# Altium schematic sheet JBC_PD_Front_End.SchDoc
size A4
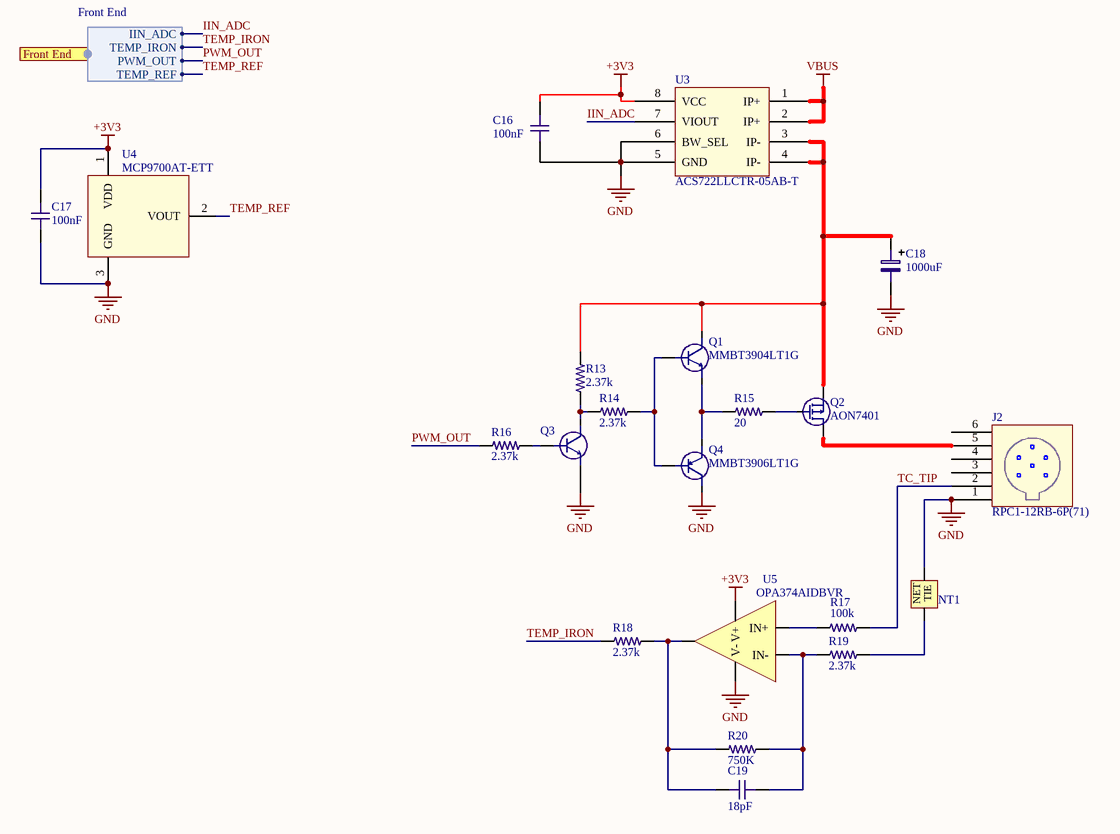
[diagram p0: JBC_PD_Front_End.SchDoc]

## Parts
C16  value 100nF  [C0603-IPC]  (hidden comment: C0603 100nF 25V X7R)
C17  value 100nF  [C0603-IPC]  (hidden comment: C0603 100nF 25V X7R)
C18  value 1000uF  [C-POLARIZED-5-12.5 Horizontal]  (hidden comment: 35ZLH1000MEFC12.5X20)
C19  value 18pF  [C0402-IPC]  (hidden comment: C0402 18pF 50V C0G_1)
J2  RPC1-12RB-6P(71)  [HIROSE RPC 1 SMD (WIRE)]
NT1  Net Tie  [NET_TIE]  (value not drawn)  (net tie, no BOM)
Q1  MMBT3904LT1G  [SOT23-MMBT3904]
Q2  AON7401  [DFN3x3A_8L_EP1_P]
Q3  MMBT3904LT1G  [SOT23-MMBT3904]  (value not drawn)
Q4  MMBT3906LT1G  [SOT23-Generic]
R13  value 2.37k  [R0603-IPC]  (hidden comment: R0603 2.37K 1%)
R14  value 2.37k  [R0603-IPC]  (hidden comment: R0603 2.37K 1%)
R15  value 20  [R1206-IPC]  (hidden comment: R1206 20 1%)
R16  value 2.37k  [R0603-IPC]  (hidden comment: R0603 2.37K 1%)
R17  value 100k  [R0603-IPC]  (hidden comment: R0603 100K 1%)
R18  value 2.37k  [R0603-IPC]  (hidden comment: R0603 2.37K 1%)
R19  value 2.37k  [R0603-IPC]  (hidden comment: R0603 2.37K 1%)
R20  value 750K  [R0603-IPC]  (hidden comment: RC0603FR-07750KL)
U3  ACS722LLCTR-05AB-T  [SOIC127P600X175-8N]
U4  MCP9700AT-ETT  [SOT23]
U5  OPA374AIDBVR  [DBV0005A]

## Ports
Front End (harness Front End)

## Harnesses
Front End: IIN_ADC, TEMP_IRON, PWM_OUT, TEMP_REF

## Nets
+3V3: C16.2 C17.2 U3.8(VCC) U4.1(VDD) U5.5(V+)
GND: C16.1 C17.1 C18.2 J2.1 NT1.2 Q3.2(E) Q4.3(C) U3.5(GND) U3.6(BW_SEL) U4.3(GND) U5.2(V-)
VBUS: U3.1(IP+) U3.2(IP+)
IIN_ADC: U3.7(VIOUT) ; port Front End.IIN_ADC
PWM_OUT: R16.1 ; port Front End.PWM_OUT
TC_TIP: J2.2 R17.1
TEMP_IRON: R18.1 ; port Front End.TEMP_IRON
TEMP_REF: U4.2(VOUT) ; port Front End.TEMP_REF
NetC18_1: C18.1 Q1.3(C) Q2.S R13.2 U3.3(IP-) U3.4(IP-)
NetC19_1: C19.1 R18.2 R20.1 U5.1(VOUT)
NetC19_2: C19.2 R19.1 R20.2 U5.4(IN-)
NetJ2_5: J2.5 Q2.D
NetNT1_1: NT1.1 R19.2
NetQ1_1: Q1.1(B) Q4.1(B) R14.2
NetQ1_2: Q1.2(E) Q4.2(E) R15.1
NetQ2_G: Q2.G R15.2
NetQ3_1: Q3.1(B) R16.2
NetQ3_3: Q3.3(C) R13.1 R14.1
NetR17_2: R17.2 U5.3(IN+)

Not connected (* = marked no-connect by the designer): J2 3 4 6

## Notes on the sheet
- (in symbol Net Tie) TIE; NET

## Library data of the parts
C16 C17 = C0603 100nF 25V X7R: Chip Capacitor, 0603, 100nF, 25V, X7R; EIA Code: X7R; Max. Voltage: 25V; Supplier 1: Digi-Key; Supplier Part Number 1: 490-1524-1-ND
C18 = C-THT 1000uF 35V Electrolytic: 1000uF ±20% 35V 12.5x20 10000Hrs @ 105℃ Radial,12.5x20mm Aluminum Electrolytic Capacitors - Leaded RoHS; Supplier 1: Digi-Key; Supplier 2: Mouser; Supplier 3: LCSC; Supplier Part Number 1: 1189-1888-ND; Supplier Part Number 2: 232-LH1000MEFC125X20; Supplier Part Number 3: C338194
C19 = C0402 18pF 50V C0G_1: Chip Capacitor, 0402, 18pF, 25V, C0G; Max. Voltage: 25V; Supplier 1: Digi-Key; Supplier Part Number 1: 399-14427-1-ND; EIA Code: C0G
J2 = Hirose RPC1: 6 Position Circular Connector Receptacle, Male Pins Solder Cup (JBC Iron Conn); Supplier 1: Digi-Key; Supplier 2: Mouser; Supplier Part Number 1: HR1817-ND; Supplier Part Number 2: 798-RPC112RB6P71
Q1 Q3 = MMBT3904LT1G: Bipolar (BJT) Transistor NPN 40V 200mA 300MHz 300mW Surface Mount SOT-23-3 (TO-236); I_max: 200mA; V_brkdown: 40V; Supplier 1: Digi-Key; Supplier 2: Mouser; Supplier 3: LCSC; Supplier Part Number 1: MMBT3904LT1GOSDKR-ND; Supplier Part Number 2: 863-MMBT3904LT1G; Supplier Part Number 3: C81464
Q2 = AON7401: P-Channel 30V 12A (Ta), 35A (Tc) 3.1W (Ta), 29W (Tc) Surface Mount 8-DFN (3x3); Supplier 1: Digi-Key; Supplier 3: LCSC; Supplier Part Number 3: C124890; Supplier Part Number 1: 785-1302-1-ND
Q4 = MMBT3906LT1G: Bipolar (BJT) Transistor PNP 40V 200mA 250MHz 300mW Surface Mount SOT-23-3 (TO-236); Supplier 1: Digi-Key; Supplier 2: Mouser; Supplier 3: LCSC; Supplier Part Number 1: MMBT3906LT1GOSCT-ND; Supplier Part Number 2: 863-MMBT3906LT1G; Supplier Part Number 3: C53444
R13 R14 R16 R18 R19 = R0603 2.37K 1%: RES SMD 2.37K OHM 1% 1/10W 0603; Supplier 1: Digi-Key; Supplier 2: Mouser; Supplier 3: LCSC; Supplier Part Number 3: C403087; Supplier Part Number 2: 667-ERJ-3EKF2371V; Supplier Part Number 1: P2.37KHCT-ND
R15 = R1206 20 1%: Chip Resistor, 1206, 20 ohms, 0.5W; Manufacturer: Stackpole Electronics Inc.; Manufacturer Part Number: RNCP1206FTD20R0; Supplier 1: Digi-Key; Supplier Part Number 1: RNCP1206FTD20R0CT-ND
R17 = R0603 100K 1%: RES SMD 100K OHM 1% 1/10W 0603; Supplier 1: Digi-Key; Supplier Part Number 1: RMCF0603FT100KCT-ND
R20 = R0603 750K 1%: RES SMD 750K OHM 1% 1/10W 0603; Temperature Coefficient: ±100ppm/°C; Tolerance: ±1%; Operating Temperature: -55°C ~ 155°C; Supplier 1: Digi-Key; Supplier 2: Mouser; Supplier 3: LCSC; Supplier Part Number 1: 311-750KHRCT-ND; Supplier Part Number 2: 603-RC0603FR-07750KL; Supplier Part Number 3: C137684
U3 = ACS722: Current Sensor 5A 1 Channel Hall Effect, Open Loop Bidirectional 8-SOIC (0.154", 3.90mm Width); Supplier 1: Digi-Key; Supplier Part Number 1: 620-1634-1-ND; Supplier 3: LCSC; Supplier Part Number 3: C116613
U4 = MCP9700AT-ETT: Temperature Sensor Analog, Local -40°C ~ 125°C 10mV/°C SOT-23-3; Supplier 1: Digi-Key; Supplier 2: Mouser; Supplier 3: LCSC; Supplier Part Number 1: MCP9700AT-E/TTCT-ND; Supplier Part Number 2: 579-MCP9700AT-E/TT; Supplier Part Number 3: C127949
U5 = OPA374: General Purpose 1 2.3V ~ 5.5V, ±1.15V ~ 2.75V 585uA 6.5MHz 5 V/us SOT-23-5 Precision OpAmps RoHS; Supplier 1: Digi-Key; Supplier 2: Mouser; Supplier 3: LCSC; Supplier Part Number 1: 296-39129-1-ND; Supplier Part Number 2: 595-OPA374AIDBVR; Supplier Part Number 3: C111859